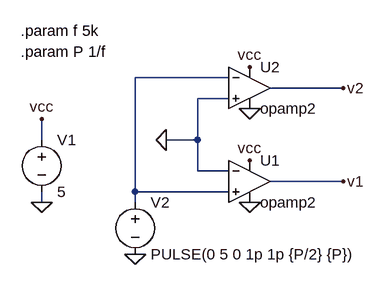
[diagram p0: schematic Draft1.asc]
Draft1.asc, the LTspice schematic file:
Version 4
SHEET 1 880 680
WIRE 128 48 -16 48
WIRE 304 64 192 64
WIRE 128 80 80 80
WIRE -160 144 -160 112
WIRE 80 144 80 80
WIRE 80 144 32 144
WIRE 80 192 80 144
WIRE 128 192 80 192
WIRE 304 208 192 208
WIRE -16 224 -16 48
WIRE 128 224 -16 224
WIRE -160 240 -160 224
WIRE -16 240 -16 224
FLAG -160 240 0
FLAG -160 112 vcc
FLAG 160 32 vcc
FLAG 160 176 vcc
FLAG 160 96 0
FLAG 160 240 0
FLAG -16 320 0
FLAG 32 144 0
FLAG 304 208 v1
FLAG 304 64 v2
SYMBOL OpAmps\\opamp2 160 144 R0
SYMATTR InstName U1
SYMBOL OpAmps\\opamp2 160 0 R0
SYMATTR InstName U2
SYMBOL voltage -160 128 R0
WINDOW 123 0 0 Left 0
WINDOW 39 0 0 Left 0
SYMATTR InstName V1
SYMATTR Value 5
SYMBOL voltage -16 224 R0
WINDOW 123 0 0 Left 0
WINDOW 39 0 0 Left 0
SYMATTR InstName V2
SYMATTR Value PULSE(0 5 0 1p 1p {P/2} {P})
TEXT -192 -24 Left 2 !.param f 5k
TEXT -192 8 Left 2 !.param P 1/f

The netlist it stands for:
* Draft1.asc
XU1 N001 0 vcc 0 v1 opamp2  ; pins In+ In- V+ V- OUT
XU2 0 N001 vcc 0 v2 opamp2  ; pins In+ In- V+ V- OUT
V1 vcc 0 5
V2 N001 0 PULSE(0 5 0 1p 1p {P/2} {P})
.param f 5k
.param P 1/f
.backanno
.end